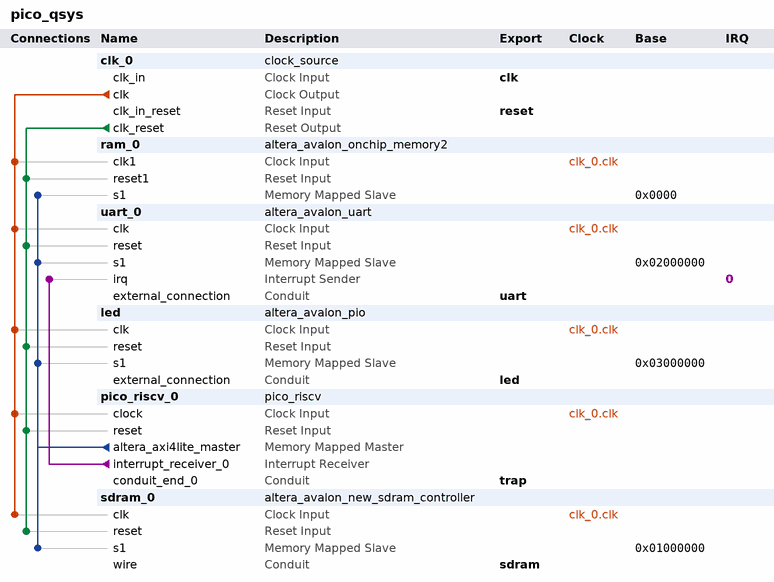
[diagram p0: system contents]
# Platform Designer (Qsys) system pico_qsys, MAX 10 10M08SAU169C8G
# Parameters at their usual value, and those the tool derives, are not listed.
package require -exact qsys 18.1
create_system pico_qsys
set_project_property DEVICE_FAMILY {MAX 10}
set_project_property DEVICE 10M08SAU169C8G

add_instance clk_0 clock_source 18.1
set_instance_parameter_value clk_0 clockFrequency 50000000

add_instance ram_0 altera_avalon_onchip_memory2 18.1
set_instance_parameter_value ram_0 dataWidth 32
set_instance_parameter_value ram_0 dualPort false
set_instance_parameter_value ram_0 initMemContent true
set_instance_parameter_value ram_0 initializationFileName /home/vagrant/develop/riscv/picorv32-soc/bootloader.hex
set_instance_parameter_value ram_0 memorySize 32768
set_instance_parameter_value ram_0 useNonDefaultInitFile true

add_instance uart_0 altera_avalon_uart 18.1
set_instance_parameter_value uart_0 baud 115200
set_instance_parameter_value uart_0 dataBits 8
set_instance_parameter_value uart_0 fixedBaud false
set_instance_parameter_value uart_0 parity NONE
set_instance_parameter_value uart_0 stopBits 1

add_instance led altera_avalon_pio 18.1
set_instance_parameter_value led direction Output
set_instance_parameter_value led width 8

add_instance pico_riscv_0 pico_riscv 1.0
set_instance_parameter_value pico_riscv_0 BARREL_SHIFTER 0
set_instance_parameter_value pico_riscv_0 CATCH_ILLINSN 1
set_instance_parameter_value pico_riscv_0 CATCH_MISALIGN 1
set_instance_parameter_value pico_riscv_0 COMPRESSED_ISA 0
set_instance_parameter_value pico_riscv_0 ENABLE_COUNTERS 1
set_instance_parameter_value pico_riscv_0 ENABLE_COUNTERS64 1
set_instance_parameter_value pico_riscv_0 ENABLE_DIV 1
set_instance_parameter_value pico_riscv_0 ENABLE_FAST_MUL 0
set_instance_parameter_value pico_riscv_0 ENABLE_IRQ 1
set_instance_parameter_value pico_riscv_0 ENABLE_IRQ_QREGS 1
set_instance_parameter_value pico_riscv_0 ENABLE_IRQ_TIMER 1
set_instance_parameter_value pico_riscv_0 ENABLE_MUL 1
set_instance_parameter_value pico_riscv_0 ENABLE_PCPI 1
set_instance_parameter_value pico_riscv_0 ENABLE_REGS_16_31 1
set_instance_parameter_value pico_riscv_0 ENABLE_REGS_DUALPORT 1
set_instance_parameter_value pico_riscv_0 ENABLE_TRACE 0
set_instance_parameter_value pico_riscv_0 LATCHED_IRQ 4294967295
set_instance_parameter_value pico_riscv_0 MASKED_IRQ 0
set_instance_parameter_value pico_riscv_0 PROGADDR_IRQ 16
set_instance_parameter_value pico_riscv_0 PROGADDR_RESET 0
set_instance_parameter_value pico_riscv_0 REGS_INIT_ZERO 0
set_instance_parameter_value pico_riscv_0 STACKADDR 25165824
set_instance_parameter_value pico_riscv_0 TWO_CYCLE_ALU 0
set_instance_parameter_value pico_riscv_0 TWO_CYCLE_COMPARE 0
set_instance_parameter_value pico_riscv_0 TWO_STAGE_SHIFT 1

add_instance sdram_0 altera_avalon_new_sdram_controller 18.1
set_instance_parameter_value sdram_0 TAC 5.4
set_instance_parameter_value sdram_0 TRCD 15.0
set_instance_parameter_value sdram_0 TRFC 65.0
set_instance_parameter_value sdram_0 TRP 15.0
set_instance_parameter_value sdram_0 TWR 16.0
set_instance_parameter_value sdram_0 casLatency 3
set_instance_parameter_value sdram_0 columnWidth 8
set_instance_parameter_value sdram_0 dataWidth 16
set_instance_parameter_value sdram_0 generateSimulationModel false
set_instance_parameter_value sdram_0 initRefreshCommands 8
set_instance_parameter_value sdram_0 model single_Micron_MT48LC4M32B2_7_chip
set_instance_parameter_value sdram_0 numberOfBanks 4
set_instance_parameter_value sdram_0 numberOfChipSelects 1
set_instance_parameter_value sdram_0 powerUpDelay 200.0
set_instance_parameter_value sdram_0 refreshPeriod 15.625
set_instance_parameter_value sdram_0 rowWidth 12

# connections
add_connection clk_0.clk led.clk clock
add_connection clk_0.clk pico_riscv_0.clock clock
add_connection clk_0.clk ram_0.clk1 clock
add_connection clk_0.clk sdram_0.clk clock
add_connection clk_0.clk uart_0.clk clock
add_connection clk_0.clk_reset led.reset reset
add_connection clk_0.clk_reset pico_riscv_0.reset reset
add_connection clk_0.clk_reset ram_0.reset1 reset
add_connection clk_0.clk_reset sdram_0.reset reset
add_connection clk_0.clk_reset uart_0.reset reset
add_connection pico_riscv_0.altera_axi4lite_master led.s1 avalon
set_connection_parameter_value pico_riscv_0.altera_axi4lite_master/led.s1 baseAddress 0x03000000
add_connection pico_riscv_0.altera_axi4lite_master ram_0.s1 avalon
set_connection_parameter_value pico_riscv_0.altera_axi4lite_master/ram_0.s1 baseAddress 0x0000
add_connection pico_riscv_0.altera_axi4lite_master sdram_0.s1 avalon
set_connection_parameter_value pico_riscv_0.altera_axi4lite_master/sdram_0.s1 baseAddress 0x01000000
add_connection pico_riscv_0.altera_axi4lite_master uart_0.s1 avalon
set_connection_parameter_value pico_riscv_0.altera_axi4lite_master/uart_0.s1 baseAddress 0x02000000
add_connection pico_riscv_0.interrupt_receiver_0 uart_0.irq interrupt
set_connection_parameter_value pico_riscv_0.interrupt_receiver_0/uart_0.irq irqNumber 0

# exported interfaces
add_interface clk clock sink
set_interface_property clk EXPORT_OF clk_0.clk_in
add_interface led conduit end
set_interface_property led EXPORT_OF led.external_connection
add_interface reset reset sink
set_interface_property reset EXPORT_OF clk_0.clk_in_reset
add_interface sdram conduit end
set_interface_property sdram EXPORT_OF sdram_0.wire
add_interface trap conduit end
set_interface_property trap EXPORT_OF pico_riscv_0.conduit_end_0
add_interface uart conduit end
set_interface_property uart EXPORT_OF uart_0.external_connection

set_interconnect_requirement {$system} qsys_mm.clockCrossingAdapter HANDSHAKE
set_interconnect_requirement {$system} qsys_mm.enableEccProtection FALSE
set_interconnect_requirement {$system} qsys_mm.insertDefaultSlave FALSE
set_interconnect_requirement {$system} qsys_mm.maxAdditionalLatency 1

save_system pico_qsys.qsys
